# Altium project rfid-mobile.PrjPcb
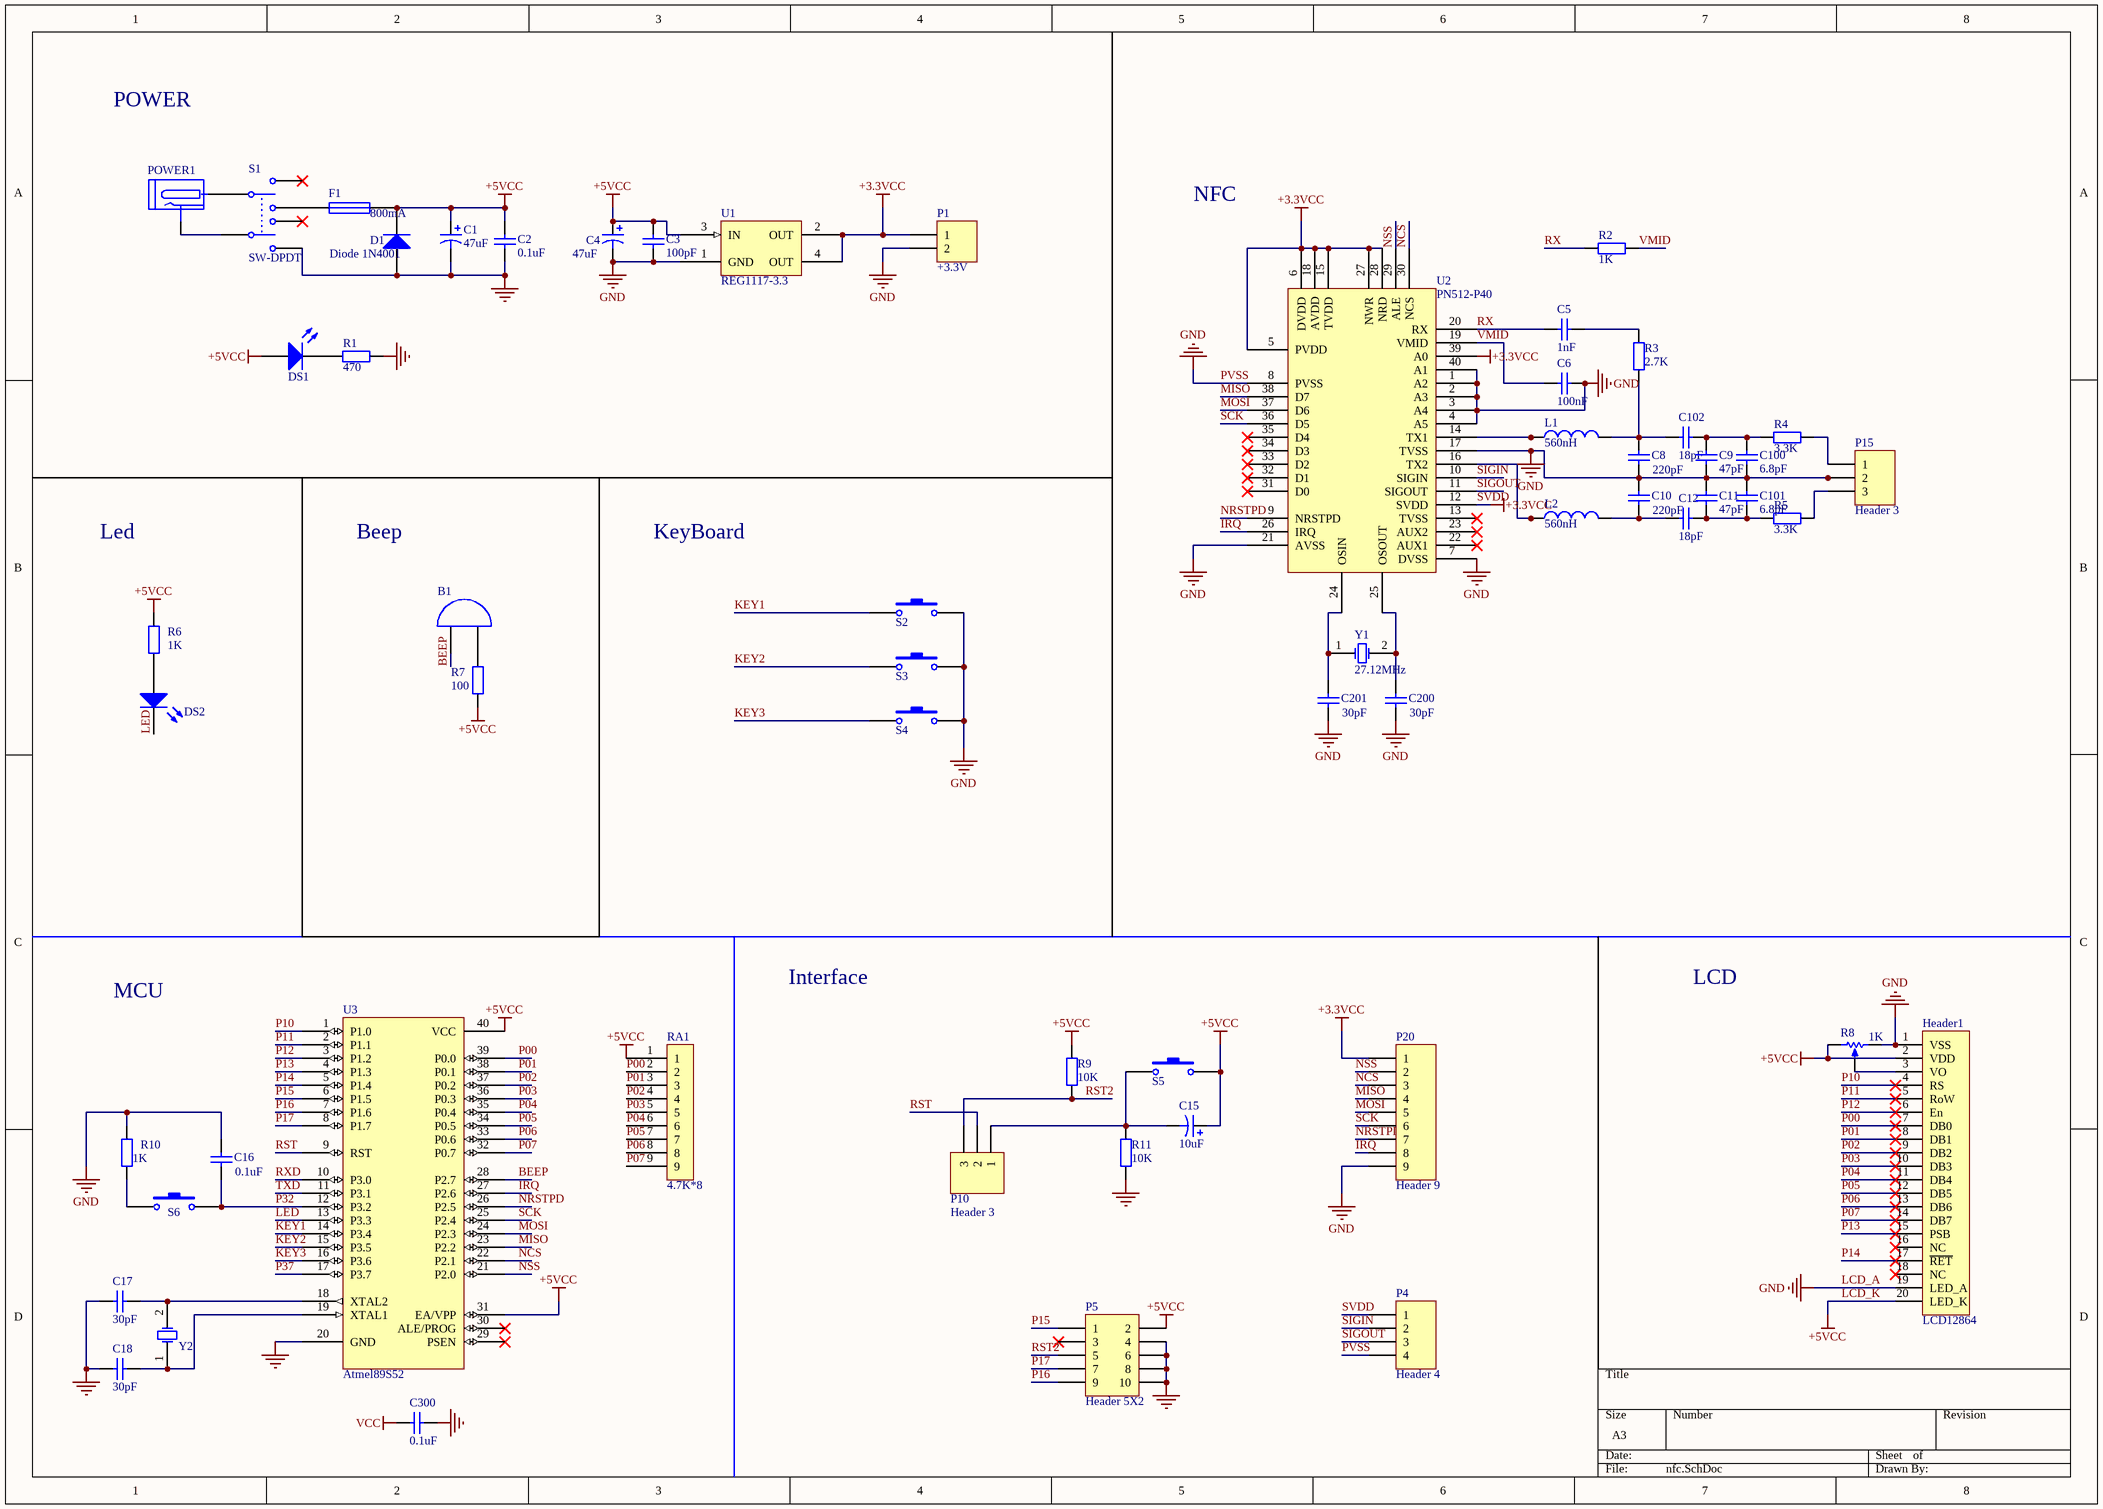
[diagram p0: nfc.SchDoc]
2 sheets, 131 parts. Net scope: global (net labels, ports and power ports of the same name join across sheets).
Board file: nfc.PcbDoc
Sheets:
  nfc.SchDoc
  MSP-RFID.SchDoc

## Sheet nfc.SchDoc
size A3; PageSetup: Record=PageOptions|CenterHorizontal=True|CenterVertical=True|PrintScale=1.00|XCorrection=1.00|YCorrection=1.00|PrintKind=1|BorderSize=5000000|LeftOffset=0|BottomOffset=0|Orientation=2|PaperLength=1000|PaperWidth=1000|Scale=100|PaperSource=7|PrintQuality=-4|MediaType=1|DitherType=10|PaperKind=A4|PrintScaleMode=1

### Parts
(Parts that share a designator on the sheet are numbered #1, #2 ... from top to bottom, then left to right.)
B1  BEEP  [Buzzer]  (value not drawn)
C1  value 47uF  [CAP-LED]  (hidden comment: CAP POL)
C2  value 0.1uF  [CAP]  (hidden comment: Cap)
C3  value 100pF  [CAP]  (hidden comment: Cap)
C4  value 47uF  [B]  (hidden comment: Cap)
C5  value 1nF  [VP32-3.2]  (hidden comment: Cap)
C6  value 100nF  [VP32-3.2]  (hidden comment: Cap)
C8  value 220pF  [VP32-3.2]  (hidden comment: Cap)
C9  value 47pF  [VP32-3.2]  (hidden comment: Cap)
C10#1  value 220pF  [VP32-3.2]  (hidden comment: Cap)
C11#1  value 47pF  [VP32-3.2]  (hidden comment: Cap)
C12#1  value 18pF  [VP32-3.2]  (hidden comment: Cap)
C15#1  value 10uF  [CAP-LED]  (hidden comment: CAP POL)
C16#1  value 0.1uF  [VP32-3.2]  (hidden comment: Cap)
C17#1  value 30pF  [CAP]  (hidden comment: Cap)
C18#1  value 30pF  [CAP]  (hidden comment: Cap)
C100  value 6.8pF  [VP32-3.2]  (hidden comment: Cap)
C101  value 6.8pF  [VP32-3.2]  (hidden comment: Cap)
C102  value 18pF  [VP32-3.2]  (hidden comment: Cap)
C200  value 30pF  [VP32-3.2]  (hidden comment: Cap)
C201  value 30pF  [VP32-3.2]  (hidden comment: Cap)
C300  value 0.1uF  [VP32-3.2]  (hidden comment: Cap)
D1#1  Diode 1N4001  [DIODE-0.4]
DS1  LED  [CAP-LED]  (value not drawn)
DS2  LED  [CAP-LED]  (value not drawn)
F1#1  value 800mA  [AXIAL-0.3]  (hidden comment: FUSE1)
Header1  LCD12864
L1  value 560nH  [0402-A]  (hidden comment: Inductor)
L2  value 560nH  [0402-A]  (hidden comment: Inductor)
P1  +3.3V  [HDR1X2]
P4  Header 4  [HDR1X4]
P5  Header 5X2  [HDR2X5]
P10  Header 3  [HDR1X3]
P15  Header 3  [HDR1X3]
P20  Header 9  [HDR1X9]
POWER1#1  POWER  [Power]  (value not drawn)
R1  value 470  [AXIAL-0.4]  (hidden comment: RES)
R2  value 1K  [AXIAL-0.4]  (hidden comment: Res2)
R3  value 2.7K  [AXIAL-0.4]  (hidden comment: Res2)
R4  value 3.3K  [AXIAL-0.4]  (hidden comment: Res2)
R5  value 3.3K  [AXIAL-0.4]  (hidden comment: Res2)
R6  value 1K  [AXIAL-0.4]  (hidden comment: RES)
R7  value 100  [AXIAL-0.4]  (hidden comment: RES)
R8  value 1K  [VR5]  (hidden comment: RPot)
R9#1  value 10K  [AXIAL-0.4]  (hidden comment: RES)
R10#1  value 1K  [AXIAL-0.4]  (hidden comment: RES)
R11#1  value 10K  [AXIAL-0.4]  (hidden comment: RES)
RA1  value 4.7K*8  [HDR1X9]  (hidden comment: Res Arry)
S1#1  SW-DPDT  [SWITCH-6]
S2  SW-PB  [key]  (value not drawn)
S3  SW-PB  [key]  (value not drawn)
S4  SW-PB  [key]  (value not drawn)
S5  SW-PB  [key]  (value not drawn)
S6  SW-PB  [key]  (value not drawn)
U1  REG1117-3.3  [SOT230P700-4BN]
U2#1  PN512-P40  [QFN50P600X600-40V2N]
U3#1  Atmel89S52  [ATMEL89S52-DIP40]
Y1#1  27.12MHz  [XTAL]
Y2#1  XTAL  [XTAL]  (value not drawn)

### Nets
LCD_A: C1.2 C2.2 C3.2 C4.2 C6.1 C8.1 C9.2 C10#1.2 C11#1.1 C16#1.2 C17#1.1 C18#1.1 C100.1 C101.1 C200.1 C201.1 C300.1 D1#1.1(A) Header1.1(VSS) Header1.19(LED_A) P1.2 P4.4 P5.4 P5.6 P5.8 P5.10 P15.2 P20.9 R1.2 R8.2(BOT) R10#1.2 R11#1.1 S1#1.6 S2.2 S3.2 S4.2 U1.1(GND) U2#1.1(A2) U2#1.2(A3) U2#1.3(A4) U2#1.4(A5) U2#1.7(DVSS) U2#1.8(PVSS) U2#1.17(TVSS) U2#1.21(AVSS) U2#1.40(A1) U3#1.20(GND)  [also labelled GND, PVSS]
LCD_K: C1.1 C2.1 C3.1 C4.1 C15#1.1 D1#1.2(K) DS1.1(A) F1#1.2 Header1.2(VDD) Header1.20(LED_K) P5.2 R6.2 R7.2 R8.1(TOP) R9#1.1 RA1.1 S5.2 U1.3(IN) U3#1.31(EA/VPP) U3#1.40(VCC)  [also labelled +5VCC]
SVDD: P1.1 P4.1 P20.1 U1.2(OUT) U1.4(OUT) U2#1.5(PVDD) U2#1.6(DVDD) U2#1.12(SVDD) U2#1.15(TVDD) U2#1.18(AVDD) U2#1.27(NWR) U2#1.28(NRD) U2#1.39(A0)  [also labelled +3.3VCC]
VCC: C300.2
BEEP: B1.2(A) U3#1.28(P2.7)
IRQ: P20.8 U2#1.26(IRQ) U3#1.27(P2.6)
KEY1: S2.1 U3#1.14(P3.4)
KEY2: S3.1 U3#1.15(P3.5)
KEY3: S4.1 U3#1.16(P3.6)
LED: DS2.2(K) U3#1.13(P3.3)
MISO: P20.4 U2#1.38(D7) U3#1.23(P2.2)
MOSI: P20.5 U2#1.37(D6) U3#1.24(P2.3)
NCS: P20.3 U2#1.30(NCS) U3#1.22(P2.1)
NRSTPD: P20.7 U2#1.9(NRSTPD) U3#1.26(P2.5)
NSS: P20.2 U2#1.29(ALE) U3#1.21(P2.0)
P00: Header1.7(DB0) RA1.2 U3#1.39(P0.0)
P01: Header1.8(DB1) RA1.3 U3#1.38(P0.1)
P02: Header1.9(DB2) RA1.4 U3#1.37(P0.2)
P03: Header1.10(DB3) RA1.5 U3#1.36(P0.3)
P04: Header1.11(DB4) RA1.6 U3#1.35(P0.4)
P05: Header1.12(DB5) RA1.7 U3#1.34(P0.5)
P06: Header1.13(DB6) RA1.8 U3#1.33(P0.6)
P07: Header1.14(DB7) RA1.9 U3#1.32(P0.7)
P10: Header1.4(RS) U3#1.1(P1.0)
P11: Header1.5(RoW) U3#1.2(P1.1)
P12: Header1.6(En) U3#1.3(P1.2)
P13: Header1.15(PSB) U3#1.4(P1.3)
P14: Header1.17(~{RET}) U3#1.5(P1.4)
P15: P5.1 U3#1.6(P1.5)
P16: P5.9 U3#1.7(P1.6)
P17: P5.7 U3#1.8(P1.7)
P32: C16#1.1 S6.2 U3#1.12(P3.2)
P37: U3#1.17(P3.7)
RST: P10.2 U3#1.9(RST)
RST2: P5.5 P10.3 R9#1.2
RX: C5.2 R2.2 U2#1.20(RX)
RXD: U3#1.10(P3.0)
SCK: P20.6 U2#1.36(D5) U3#1.25(P2.4)
SIGIN: P4.2 U2#1.10(SIGIN)
SIGOUT: P4.3 U2#1.11(SIGOUT)
TXD: U3#1.11(P3.1)
VMID: C6.2 R2.1 U2#1.19(VMID)
NetB1_1: B1.1(B) R7.1
NetC5_1: C5.1 R3.2
NetC8_2: C8.2 C102.2 L1.2 R3.1
NetC9_1: C9.1 C100.2 C102.1 R4.2
NetC10#1_1: C10#1.1 C12#1.2 L2.2
NetC11#1_2: C11#1.2 C12#1.1 C101.2 R5.2
NetC15#1_2: C15#1.2 P10.1 R11#1.2 S5.1
NetC17#1_2: C17#1.2 U3#1.18(XTAL2) Y2#1.2(OSC2)
NetC18#1_2: C18#1.2 U3#1.19(XTAL1) Y2#1.1(OSC1)
NetC200_2: C200.2 U2#1.25(OSOUT) Y1#1.2(OSC2)
NetC201_2: C201.2 U2#1.24(OSIN) Y1#1.1(OSC1)
NetDS1_2: DS1.2(K) R1.1
NetDS2_1: DS2.1(A) R6.1
NetF1#1_1: F1#1.1 S1#1.3
NetHeader1_3: Header1.3(VO) R8.3(TAP)
NetL1_1: L1.1 U2#1.14(TX1)
NetL2_1: L2.1 U2#1.16(TX2)
NetP15_1: P15.1 R4.1
NetP15_3: P15.3 R5.1
NetPOWER1#1_1: POWER1#1.1 S1#1.1
NetPOWER1#1_2: POWER1#1.2 S1#1.4
NetR10#1_1: R10#1.1 S6.1

Not connected (* = marked no-connect by the designer): Header1 16(NC)* 18(NC)*; P5 3*; S1#1 2* 5*; U2#1 13(TVSS)* 22(AUX1)* 23(AUX2)* 31(D0)* 32(D1)* 33(D2)* 34(D3)* 35(D4)*; U3#1 29(PSEN)* 30(ALE/PROG)*

### Notes on the sheet
- POWER
- NFC
- Led
- Beep
- KeyBoard
- Interface
- LCD
- MCU

### Library data of the parts
C1 C15#1 = CAP POL: Polarized Capacitor (Axial)
C2 C3 C5 C6 C8 C9 C10#1 C11#1 C12#1 C16#1 C17#1 C18#1 C100-C102 C200 C201 C300 = Cap: Capacitor
C4 = Cap Pol1: Polarized Capacitor (Radial)
D1#1 = Diode 1N4001: 1 Amp General Purpose Rectifier; Revision 1: 11-Jul-2000: SIM Model Added.; Revision 2: 17-Jul-2002: Re-released for DXP Platform.; Package Information: Latest Revision: Aug-1999; Code - JEDEC: DO-204-AL
L1 L2 = Inductor: Code_IEC: 1005; Published: 8-Jun-2000; LatestRevisionDate: 17-Jul-2002; LatestRevisionNote: Re-released for DXP Platform.; PackageReference: 0402-A; Publisher: Altium Limited; Code_JEITA: 0402
P1 = Header 2: Header, 2-Pin
P4 = Header 4: Header, 4-Pin
P5 = Header 5X2: Header, 5-Pin, Dual row
P10 P15 = Header 3: Header, 3-Pin
P20 = Header 9: Header, 9-Pin
R1 R6 R7 R9#1 R10#1 R11#1 = RES: Resistor
R2-R5 = Res2: Resistor
R8 = RPot: Potentiometer; Sim Note: Enter the Resistance value and the set point into parameter fields.; Set Position: 0.5
S1#1 = SW-DPDT: Double-Pole, Double-Throw Switch
U2#1 = PN511-P40
Y1#1 Y2#1 = XTAL: Crystal Oscillator

## Sheet MSP-RFID.SchDoc
size A3; PageSetup: Record=PageOptions|CenterHorizontal=True|CenterVertical=True|PrintScale=0.71|XCorrection=1.00|YCorrection=1.00|PrintKind=1|BorderSize=5000000|LeftOffset=0|BottomOffset=0|Orientation=2|PaperLength=1000|PaperWidth=1000|Scale=100|PaperSource=7|PrintQuality=-4|MediaType=1|DitherType=10|PaperKind=A3|PrintScaleMode=1
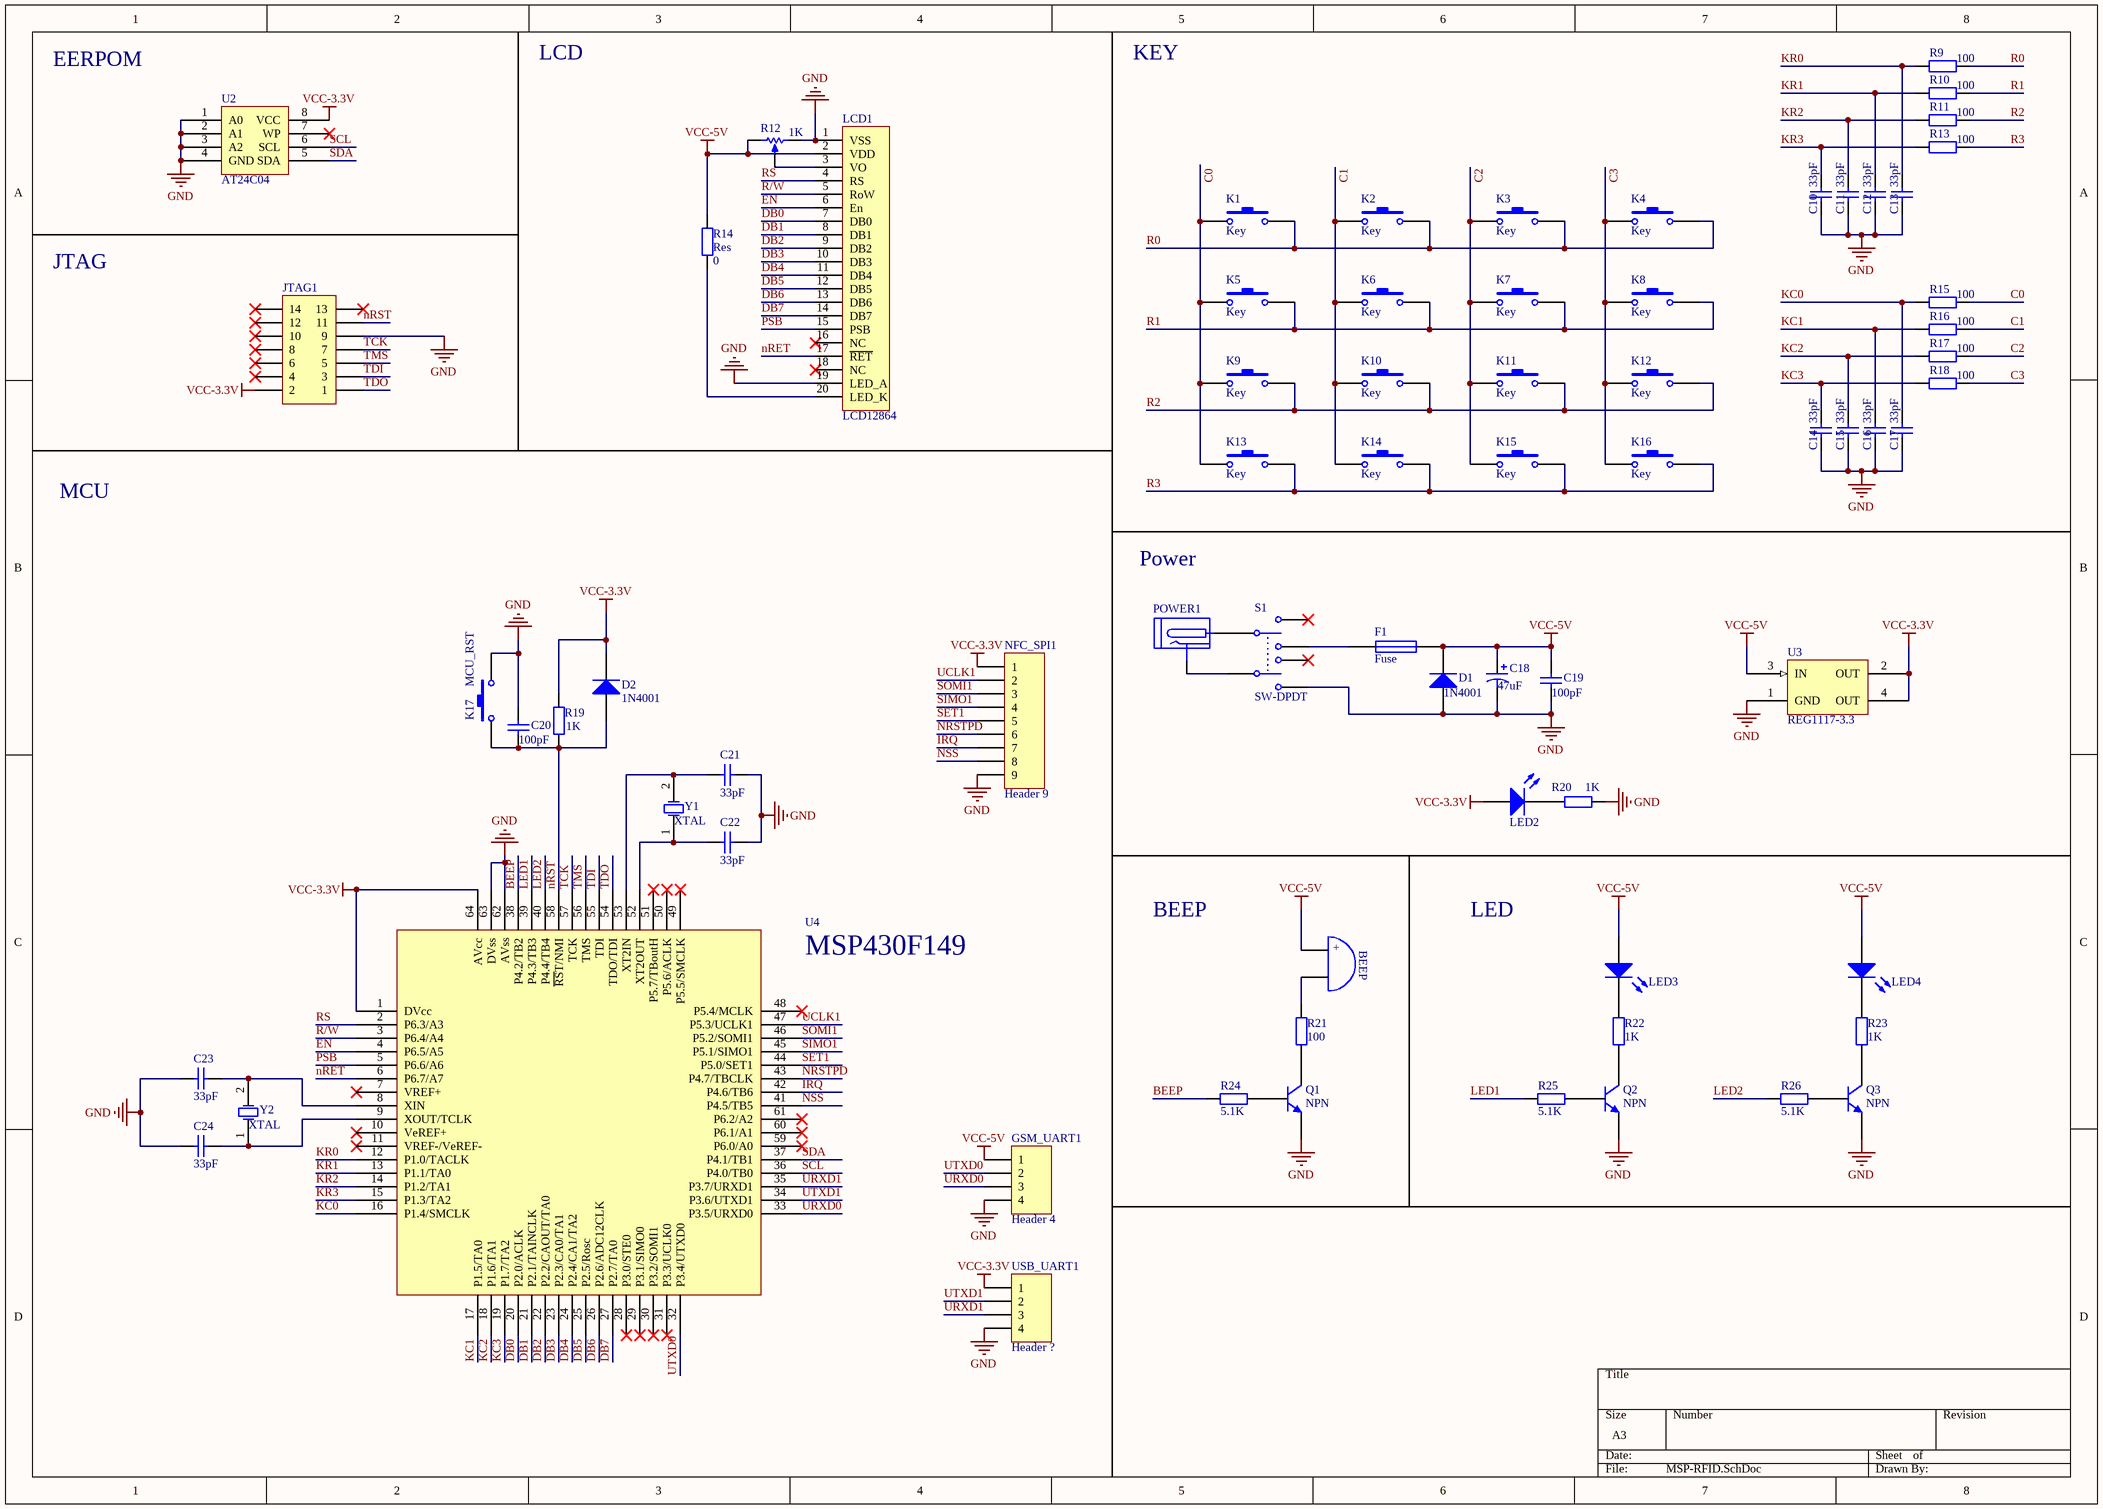
[diagram p1: MSP-RFID.SchDoc]

### Parts
(Parts that share a designator on the sheet are numbered #1, #2 ... from top to bottom, then left to right.)
BEEP1  BEEP  [BEEP]  (value not drawn)
C10#2  value 33pF  [1608[0603]]  (hidden comment: Cap)
C11#2  value 33pF  [1608[0603]]  (hidden comment: Cap)
C12#2  value 33pF  [1608[0603]]  (hidden comment: Cap)
C13  value 33pF  [1608[0603]]  (hidden comment: Cap)
C14  value 33pF  [1608[0603]]  (hidden comment: Cap)
C15#2  value 33pF  [1608[0603]]  (hidden comment: Cap)
C16#2  value 33pF  [1608[0603]]  (hidden comment: Cap)
C17#2  value 33pF  [1608[0603]]  (hidden comment: Cap)
C18#2  value 47uF  [1608[0603] - POL]  (hidden comment: CAP POL)
C19  value 100pF  [1608[0603]]  (hidden comment: Cap)
C20  value 100pF  [1608[0603]]  (hidden comment: Cap)
C21  value 33pF  [1608[0603]]  (hidden comment: Cap)
C22  value 33pF  [1608[0603]]  (hidden comment: Cap)
C23  value 33pF  [1608[0603]]  (hidden comment: Cap)
C24  value 33pF  [1608[0603]]  (hidden comment: Cap)
D1#2  1N4001  [1608[0603] - POL]
D2  1N4001  [1608[0603] - POL]
F1#2  Fuse  [1608[0603]]
GSM_UART1  Header 4  [HDR1X4]
JTAG1  Header 7X2H  [HDR2X7H]  (value not drawn)
K1  Key  [Key-4]
K2  Key  [Key-4]
K3  Key  [Key-4]
K4  Key  [Key-4]
K5  Key  [Key-4]
K6  Key  [Key-4]
K7  Key  [Key-4]
K8  Key  [Key-4]
K9  Key  [Key-4]
K10  Key  [Key-4]
K11  Key  [Key-4]
K12  Key  [Key-4]
K13  Key  [Key-4]
K14  Key  [Key-4]
K15  Key  [Key-4]
K16  Key  [Key-4]
K17  MCU_RST  [Key-4]
LCD1  LCD12864  [LCD-20PIN]
LED2  LED  [2012[0805] - POL]  (value not drawn)
LED3  LED  [1608[0603] - POL]  (value not drawn)
LED4  LED  [1608[0603] - POL]  (value not drawn)
NFC_SPI1  Header 9  [HDR1X9]
POWER1#2  POWER  [POWER]  (value not drawn)
Q1  NPN  [SOT23-3L]
Q2  NPN  [SOT23-3L]
Q3  NPN  [SOT23-3L]
R9#2  value 100  [1608[0603]]  (hidden comment: RES)
R10#2  value 100  [1608[0603]]  (hidden comment: RES)
R11#2  value 100  [1608[0603]]  (hidden comment: RES)
R12  value 1K  [VR5]  (hidden comment: RPot)
R13  value 100  [1608[0603]]  (hidden comment: RES)
R14  Res  value 0  [1608[0603]]
R15  value 100  [1608[0603]]  (hidden comment: RES)
R16  value 100  [1608[0603]]  (hidden comment: RES)
R17  value 100  [1608[0603]]  (hidden comment: RES)
R18  value 100  [1608[0603]]  (hidden comment: RES)
R19  value 1K  [1608[0603]]  (hidden comment: Res)
R20  value 1K  [1608[0603]]  (hidden comment: Res)
R21  value 100  [1608[0603]]  (hidden comment: Res)
R22  value 1K  [1608[0603]]  (hidden comment: Res)
R23  value 1K  [1608[0603]]  (hidden comment: Res)
R24  value 5.1K  [1608[0603]]  (hidden comment: Res)
R25  value 5.1K  [1608[0603]]  (hidden comment: Res)
R26  value 5.1K  [1608[0603]]  (hidden comment: Res)
S1#2  SW-DPDT  [DPDT-6]
U2#2  AT24C04  [SOIC127P600-8AN]
U3#2  REG1117-3.3  [SOT223]
U4  MSP430F149  [SQFP50P1200X1200-64N]
USB_UART1  Header ?  [HDR1X4]
Y1#2  XTAL  [XTAL]
Y2#2  XTAL  [XTAL]

### Nets
GND: C10#2.2 C11#2.2 C12#2.2 C13.2 C14.2 C15#2.2 C16#2.2 C17#2.2 C18#2.2 C19.1 C20.2 C21.1 C22.1 C23.2 C24.2 D1#2.1(A) GSM_UART1.4 JTAG1.9 K17.2 LCD1.1(VSS) LCD1.19(LED_A) NFC_SPI1.9 Q1.3(E) Q2.3(E) Q3.3(E) R12.2(BOT) R20.2 S1#2.6 U2#2.1(A0) U2#2.2(A1) U2#2.3(A2) U2#2.4(GND) U3#2.1(GND) U4.62(AVss) U4.63(DVss) USB_UART1.4  [project net LCD_A]
VCC-3.3V: D2.2(K) JTAG1.2 LED2.1(A) NFC_SPI1.1 R19.2 U2#2.8(VCC) U3#2.2(OUT) U3#2.4(OUT) U4.1(DVcc) U4.64(AVcc) USB_UART1.1
VCC-5V: BEEP1.1(B) C18#2.1 C19.2 D1#2.2(K) F1#2.2 GSM_UART1.1 LCD1.2(VDD) LED3.1(A) LED4.1(A) R12.1(TOP) R14.2 U3#2.3(IN)
BEEP: R24.1 U4.38(P4.2/TB2)
C0: K1.1 K5.1 K9.1 K13.1 R15.2
C1: K2.1 K6.1 K10.1 K14.1 R16.2
C2: K3.1 K7.1 K11.1 K15.1 R17.2
C3: K4.1 K8.1 K12.1 K16.1 R18.2
DB0: LCD1.7(DB0) U4.20(P2.0/ACLK)
DB1: LCD1.8(DB1) U4.21(P2.1/TAINCLK)
DB2: LCD1.9(DB2) U4.22(P2.2/CAOUT/TA0)
DB3: LCD1.10(DB3) U4.23(P2.3/CA0/TA1)
DB4: LCD1.11(DB4) U4.24(P2.4/CA1/TA2)
DB5: LCD1.12(DB5) U4.25(P2.5/Rosc)
DB6: LCD1.13(DB6) U4.26(P2.6/ADC12CLK)
DB7: LCD1.14(DB7) U4.27(P2.7/TA0)
EN: LCD1.6(En) U4.4(P6.5/A5)
IRQ: NFC_SPI1.7 U4.42(P4.6/TB6)
KC0: C17#2.1 R15.1 U4.16(P1.4/SMCLK)
KC1: C16#2.1 R16.1 U4.17(P1.5/TA0)
KC2: C15#2.1 R17.1 U4.18(P1.6/TA1)
KC3: C14.1 R18.1 U4.19(P1.7/TA2)
KR0: C13.1 R9#2.1 U4.12(P1.0/TACLK)
KR1: C12#2.1 R10#2.1 U4.13(P1.1/TA0)
KR2: C11#2.1 R11#2.1 U4.14(P1.2/TA1)
KR3: C10#2.1 R13.1 U4.15(P1.3/TA2)
LED1: R25.1 U4.39(P4.3/TB3)
LED2: R26.1 U4.40(P4.4/TB4)
nRET: LCD1.17(~{RET}) U4.6(P6.7/A7)
nRST: C20.1 D2.1(A) JTAG1.11 K17.1 R19.1 U4.58(~{RS}T/NMI)
NRSTPD: NFC_SPI1.6 U4.43(P4.7/TBCLK)
NSS: NFC_SPI1.8 U4.41(P4.5/TB5)
PSB: LCD1.15(PSB) U4.5(P6.6/A6)
R0: K1.2 K2.2 K3.2 K4.2 R9#2.2
R1: K5.2 K6.2 K7.2 K8.2 R10#2.2
R2: K9.2 K10.2 K11.2 K12.2 R11#2.2
R3: K13.2 K14.2 K15.2 K16.2 R13.2
R/W: LCD1.5(RoW) U4.3(P6.4/A4)
RS: LCD1.4(RS) U4.2(P6.3/A3)
SCL: U2#2.6(SCL) U4.36(P4.0/TB0)
SDA: U2#2.5(SDA) U4.37(P4.1/TB1)
SET1: NFC_SPI1.5 U4.44(P5.0/SET1)
SIMO1: NFC_SPI1.4 U4.45(P5.1/SIMO1)
SOMI1: NFC_SPI1.3 U4.46(P5.2/SOMI1)
TCK: JTAG1.7 U4.57(TCK)
TDI: JTAG1.3 U4.55(TDI)
TDO: JTAG1.1 U4.54(TDO/TDI)
TMS: JTAG1.5 U4.56(TMS)
UCLK1: NFC_SPI1.2 U4.47(P5.3/UCLK1)
URXD0: GSM_UART1.3 U4.33(P3.5/URXD0)
URXD1: U4.35(P3.7/URXD1) USB_UART1.3
UTXD0: GSM_UART1.2 U4.32(P3.4/UTXD0)
UTXD1: U4.34(P3.6/UTXD1) USB_UART1.2
NetBEEP1_2: BEEP1.2(A) R21.1
NetC21_2: C21.2 U4.53(XT2IN) Y1#2.2(OSC2)
NetC22_2: C22.2 U4.52(XT2OUT) Y1#2.1(OSC1)
NetC23_1: C23.1 U4.8(XIN) Y2#2.2(OSC2)
NetC24_1: C24.1 U4.9(XOUT/TCLK) Y2#2.1(OSC1)
NetF1#2_1: F1#2.1 S1#2.3
NetLCD1_3: LCD1.3(VO) R12.3(TAP)
NetLCD1_20: LCD1.20(LED_K) R14.1
NetLED2_2: LED2.2(K) R20.1
NetLED3_2: LED3.2(K) R22.1
NetLED4_2: LED4.2(K) R23.1
NetPOWER1#2_1: POWER1#2.1 S1#2.1
NetPOWER1#2_2: POWER1#2.2 S1#2.4
NetQ1_1: Q1.1(C) R21.2
NetQ1_2: Q1.2(B) R24.2
NetQ2_1: Q2.1(C) R22.2
NetQ2_2: Q2.2(B) R25.2
NetQ3_1: Q3.1(C) R23.2
NetQ3_2: Q3.2(B) R26.2

Not connected (* = marked no-connect by the designer): JTAG1 4* 6* 8* 10* 12* 13* 14*; LCD1 16(NC)* 18(NC)*; S1#2 2* 5*; U2#2 7(WP)*; U4 7(VREF+)* 10(VeREF+)* 11(VREF-/VeREF-)* 28(P3.0/STE0)* 29(P3.1/SIMO0)* 30(P3.2/SOMI1)* 31(P3.3/UCLK0)* 48(P5.4/MCLK)* 49(P5.5/SMCLK)* 50(P5.6/ACLK)* 51(P5.7/TBoutH)* 59(P6.0/A0)* 60(P6.1/A1)* 61(P6.2/A2)*

### Notes on the sheet
- EERPOM
- LCD
- KEY
- JTAG
- MCU
- Power
- BEEP
- LED
- (in symbol BEEP) +

### Library data of the parts
C10#2 C11#2 C12#2 C13 C14 C15#2 C16#2 C17#2 C19-C24 = Cap: Capacitor; Published: 8-Jun-2000; LatestRevisionDate: 17-Jul-2002; LatestRevisionNote: Re-released for DXP Platform.; Publisher: Altium Limited
C18#2 = CAP POL: Polarized Capacitor (Axial); Published: 8-Jun-2000; LatestRevisionDate: 17-Jul-2002; LatestRevisionNote: Re-released for DXP Platform.; Publisher: Altium Limited
D1#2 D2 = Diode 1N4001: as D1#1 on sheet nfc; Published: 8-Jun-2000; Datasheet: Latest Revision: 1998; Package Reference: DO-41; Publisher: Altium Limited
F1#2 = FUSE1
GSM_UART1 USB_UART1 = Header 4: Header, 4-Pin; LatestRevisionDate: 17-Jul-2002; LatestRevisionNote: Re-released for DXP Platform.; Publisher: Altium Limited
JTAG1 = Header 7X2H: Header, 7-Pin, Dual row, Right Angle; LatestRevisionDate: 17-Jul-2002; LatestRevisionNote: Re-released for DXP Platform.; Publisher: Altium Limited
K1-K17 = SW-PB
NFC_SPI1 = Header 9: Header, 9-Pin; LatestRevisionDate: 17-Jul-2002; LatestRevisionNote: Re-released for DXP Platform.; Publisher: Altium Limited
Q1-Q3 = NPN: pin to pad: 1>3 2>1 3>2
R9#2 R10#2 R11#2 R13-R26 = RES: Resistor; Published: 8-Jun-2000; LatestRevisionDate: 17-Jul-2002; LatestRevisionNote: Re-released for DXP Platform.; Publisher: Altium Limited
R12 = RPot: as R8 on sheet nfc; Published: 8-Jun-2000; LatestRevisionDate: 17-Jul-2002; LatestRevisionNote: Re-released for DXP Platform.; PackageReference: VR5; Publisher: Altium Limited
S1#2 = SW-DPDT: Double-Pole, Double-Throw Switch; Published: 24-Mar-1999; LatestRevisionDate: 17-Jul-2002; LatestRevisionNote: Re-released for DXP Platform.; PackageReference: DPDT-6; Publisher: Altium Limited
U4 = F14X
Y1#2 Y2#2 = XTAL: Crystal Oscillator; Published: 8-Jun-2000; Revision: July-2002: Re-released for DXP Platform.; Publisher: Altium Limited

## Nets that join several sheets
LCD_A: nfc (47 pins), MSP-RFID (36 pins)
BEEP: nfc (B1.2 U3#1.28), MSP-RFID (R24.1 U4.38)
IRQ: nfc (P20.8 U2#1.26 U3#1.27), MSP-RFID (NFC_SPI1.7 U4.42)
NRSTPD: nfc (P20.7 U2#1.9 U3#1.26), MSP-RFID (NFC_SPI1.6 U4.43)
NSS: nfc (P20.2 U2#1.29 U3#1.21), MSP-RFID (NFC_SPI1.8 U4.41)